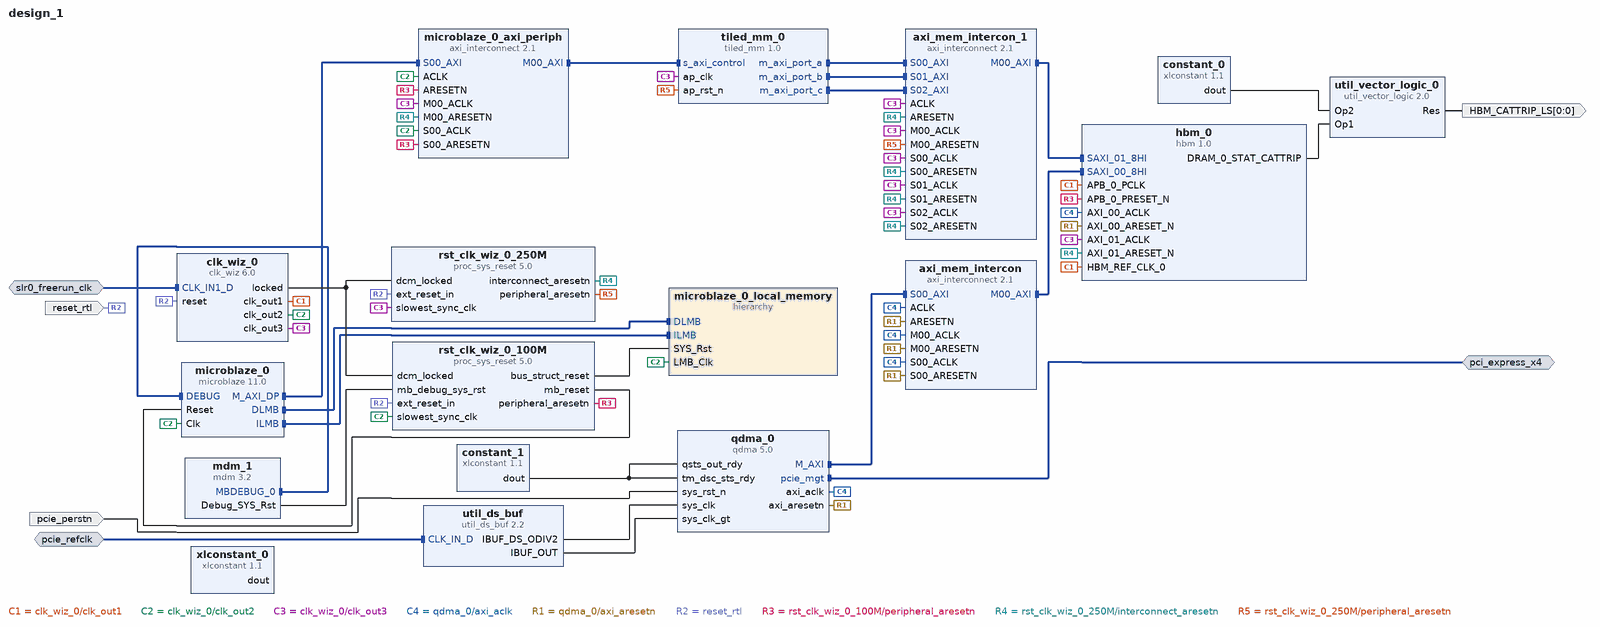
[diagram p0: block diagram of the top level]
# Vivado block design design_1, xcu55c-fsvh2892-2L-e, Vivado 2023.2.2
create_bd_design design_1

create_bd_intf_port -mode Slave -vlnv xilinx.com:interface:diff_clock_rtl:1.0 slr0_freerun_clk
set_property -dict {CONFIG.FREQ_HZ 100000000} [get_bd_intf_ports slr0_freerun_clk]
create_bd_intf_port -mode Master -vlnv xilinx.com:interface:pcie_7x_mgt_rtl:1.0 pci_express_x4
create_bd_intf_port -mode Slave -vlnv xilinx.com:interface:diff_clock_rtl:1.0 pcie_refclk
set_property -dict {CONFIG.FREQ_HZ 100000000} [get_bd_intf_ports pcie_refclk]
create_bd_port -dir I -type rst reset_rtl
set_property -dict {CONFIG.POLARITY ACTIVE_HIGH} [get_bd_ports reset_rtl]
create_bd_port -dir I -type rst pcie_perstn
set_property -dict {CONFIG.POLARITY ACTIVE_LOW} [get_bd_ports pcie_perstn]
create_bd_port -dir O -from 0 -to 0 HBM_CATTRIP_LS

create_bd_cell -type ip -vlnv xilinx.com:ip:clk_wiz:6.0 clk_wiz_0
set_property -dict [list \
  CONFIG.CLKOUT1_JITTER 115.831 \
  CONFIG.CLKOUT1_PHASE_ERROR 87.180 \
  CONFIG.CLKOUT2_JITTER 115.831 \
  CONFIG.CLKOUT2_PHASE_ERROR 87.180 \
  CONFIG.CLKOUT2_USED true \
  CONFIG.CLKOUT3_JITTER 90.074 \
  CONFIG.CLKOUT3_PHASE_ERROR 87.180 \
  CONFIG.CLKOUT3_REQUESTED_OUT_FREQ 400 \
  CONFIG.CLKOUT3_USED true \
  CONFIG.CLK_IN1_BOARD_INTERFACE slr0_freerun_clk \
  CONFIG.MMCM_CLKFBOUT_MULT_F 12.000 \
  CONFIG.MMCM_CLKOUT0_DIVIDE_F 12.000 \
  CONFIG.MMCM_CLKOUT1_DIVIDE 12 \
  CONFIG.MMCM_CLKOUT2_DIVIDE 3 \
  CONFIG.NUM_OUT_CLKS 3 \
  CONFIG.OPTIMIZE_CLOCKING_STRUCTURE_EN true \
  CONFIG.RESET_BOARD_INTERFACE Custom \
  CONFIG.USE_BOARD_FLOW true \
] [get_bd_cells clk_wiz_0]
create_bd_cell -type ip -vlnv xilinx.com:ip:qdma:5.0 qdma_0
set_property -dict [list \
  CONFIG.PCIE_BOARD_INTERFACE pci_express_x4 \
  CONFIG.SYS_RST_N_BOARD_INTERFACE pcie_perstn \
  CONFIG.axi_data_width 256_bit \
  CONFIG.axilite_master_en false \
  CONFIG.axisten_freq 250 \
  CONFIG.dma_intf_sel_qdma AXI_MM \
  CONFIG.pl_link_cap_max_link_speed 16.0_GT/s \
] [get_bd_cells qdma_0]
create_bd_cell -type ip -vlnv xilinx.com:ip:util_ds_buf:2.2 util_ds_buf
set_property -dict {CONFIG.DIFF_CLK_IN_BOARD_INTERFACE pcie_refclk CONFIG.USE_BOARD_FLOW true} [get_bd_cells util_ds_buf]
create_bd_cell -type ip -vlnv xilinx.com:ip:hbm:1.0 hbm_0
set_property -dict [list \
  CONFIG.USER_APB_EN false \
  CONFIG.USER_SAXI_01 true \
  CONFIG.USER_SAXI_02 false \
  CONFIG.USER_SAXI_03 false \
  CONFIG.USER_SAXI_04 false \
  CONFIG.USER_SAXI_05 false \
  CONFIG.USER_SAXI_06 false \
  CONFIG.USER_SAXI_07 false \
  CONFIG.USER_SAXI_08 false \
  CONFIG.USER_SAXI_09 false \
  CONFIG.USER_SAXI_10 false \
  CONFIG.USER_SAXI_11 false \
  CONFIG.USER_SAXI_12 false \
  CONFIG.USER_SAXI_13 false \
  CONFIG.USER_SAXI_14 false \
  CONFIG.USER_SAXI_15 false \
] [get_bd_cells hbm_0]
create_bd_cell -type ip -vlnv xilinx.com:ip:axi_interconnect:2.1 axi_mem_intercon
set_property -dict [list \
  CONFIG.ENABLE_ADVANCED_OPTIONS 0 \
  CONFIG.NUM_MI 1 \
  CONFIG.S00_HAS_DATA_FIFO 0 \
  CONFIG.S00_HAS_REGSLICE 4 \
] [get_bd_cells axi_mem_intercon]
create_bd_cell -type ip -vlnv xilinx.com:ip:xlconstant:1.1 constant_1
create_bd_cell -type ip -vlnv xilinx.com:ip:proc_sys_reset:5.0 rst_clk_wiz_0_100M
create_bd_cell -type ip -vlnv xilinx.com:ip:microblaze:11.0 microblaze_0
set_property -dict [list \
  CONFIG.C_ADDR_SIZE 36 \
  CONFIG.C_DEBUG_ENABLED 1 \
  CONFIG.C_D_AXI 1 \
  CONFIG.C_D_LMB 1 \
  CONFIG.C_I_LMB 1 \
  CONFIG.C_USE_BARREL 1 \
  CONFIG.C_USE_BRANCH_TARGET_CACHE 1 \
  CONFIG.C_USE_FPU 0 \
  CONFIG.C_USE_MSR_INSTR 1 \
  CONFIG.C_USE_PCMP_INSTR 1 \
] [get_bd_cells microblaze_0]
create_bd_cell -type hier microblaze_0_local_memory
create_bd_cell -type ip -vlnv xilinx.com:ip:mdm:3.2 mdm_1
create_bd_cell -type ip -vlnv xilinx.com:ip:axi_interconnect:2.1 microblaze_0_axi_periph
set_property -dict {CONFIG.NUM_MI 1} [get_bd_cells microblaze_0_axi_periph]
create_bd_cell -type ip -vlnv xilinx.com:ip:xlconstant:1.1 constant_0
set_property -dict {CONFIG.CONST_VAL 0} [get_bd_cells constant_0]
create_bd_cell -type ip -vlnv xilinx.com:ip:util_vector_logic:2.0 util_vector_logic_0
set_property -dict {CONFIG.C_OPERATION or CONFIG.C_SIZE 1} [get_bd_cells util_vector_logic_0]
create_bd_cell -type ip -vlnv xilinx.com:hls:tiled_mm:1.0 tiled_mm_0
create_bd_cell -type ip -vlnv xilinx.com:ip:proc_sys_reset:5.0 rst_clk_wiz_0_250M
create_bd_cell -type ip -vlnv xilinx.com:ip:axi_interconnect:2.1 axi_mem_intercon_1
set_property -dict {CONFIG.NUM_MI 1 CONFIG.NUM_SI 3} [get_bd_cells axi_mem_intercon_1]
create_bd_cell -type ip -vlnv xilinx.com:ip:xlconstant:1.1 xlconstant_0

# ---- hierarchy /microblaze_0_local_memory ----
current_bd_instance /microblaze_0_local_memory
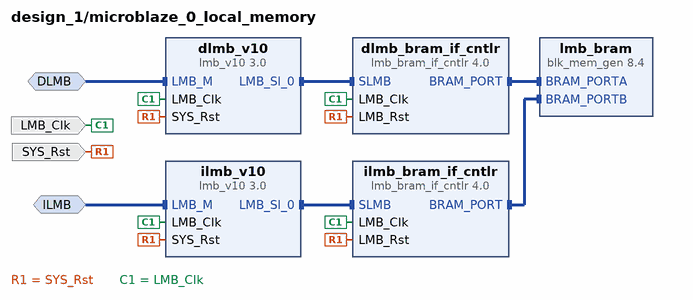
[diagram p1: block diagram inside /microblaze_0_local_memory]
create_bd_intf_pin -mode MirroredMaster -vlnv xilinx.com:interface:lmb_rtl:1.0 DLMB
create_bd_intf_pin -mode MirroredMaster -vlnv xilinx.com:interface:lmb_rtl:1.0 ILMB
create_bd_pin -dir I -type clk LMB_Clk
create_bd_pin -dir I -type rst SYS_Rst

create_bd_cell -type ip -vlnv xilinx.com:ip:lmb_v10:3.0 dlmb_v10
create_bd_cell -type ip -vlnv xilinx.com:ip:lmb_v10:3.0 ilmb_v10
create_bd_cell -type ip -vlnv xilinx.com:ip:lmb_bram_if_cntlr:4.0 dlmb_bram_if_cntlr
set_property -dict {CONFIG.C_ECC 0} [get_bd_cells dlmb_bram_if_cntlr]
create_bd_cell -type ip -vlnv xilinx.com:ip:lmb_bram_if_cntlr:4.0 ilmb_bram_if_cntlr
set_property -dict {CONFIG.C_ECC 0} [get_bd_cells ilmb_bram_if_cntlr]
create_bd_cell -type ip -vlnv xilinx.com:ip:blk_mem_gen:8.4 lmb_bram
set_property -dict {CONFIG.Memory_Type True_Dual_Port_RAM CONFIG.use_bram_block BRAM_Controller} [get_bd_cells lmb_bram]

# ---- connections ----

current_bd_instance /microblaze_0_local_memory
connect_bd_intf_net -intf_net microblaze_0_dlmb [get_bd_intf_pins dlmb_v10/LMB_M] [get_bd_intf_pins DLMB]
connect_bd_intf_net -intf_net microblaze_0_dlmb_bus [get_bd_intf_pins dlmb_v10/LMB_Sl_0] [get_bd_intf_pins dlmb_bram_if_cntlr/SLMB]
connect_bd_intf_net -intf_net microblaze_0_dlmb_cntlr [get_bd_intf_pins dlmb_bram_if_cntlr/BRAM_PORT] [get_bd_intf_pins lmb_bram/BRAM_PORTA]
connect_bd_intf_net -intf_net microblaze_0_ilmb [get_bd_intf_pins ilmb_v10/LMB_M] [get_bd_intf_pins ILMB]
connect_bd_intf_net -intf_net microblaze_0_ilmb_bus [get_bd_intf_pins ilmb_v10/LMB_Sl_0] [get_bd_intf_pins ilmb_bram_if_cntlr/SLMB]
connect_bd_intf_net -intf_net microblaze_0_ilmb_cntlr [get_bd_intf_pins ilmb_bram_if_cntlr/BRAM_PORT] [get_bd_intf_pins lmb_bram/BRAM_PORTB]
connect_bd_net [get_bd_pins SYS_Rst] \
  [get_bd_pins dlmb_v10/SYS_Rst] [get_bd_pins dlmb_bram_if_cntlr/LMB_Rst] [get_bd_pins ilmb_v10/SYS_Rst] \
  [get_bd_pins ilmb_bram_if_cntlr/LMB_Rst]
connect_bd_net -net microblaze_0_Clk [get_bd_pins LMB_Clk] \
  [get_bd_pins dlmb_v10/LMB_Clk] [get_bd_pins dlmb_bram_if_cntlr/LMB_Clk] [get_bd_pins ilmb_v10/LMB_Clk] \
  [get_bd_pins ilmb_bram_if_cntlr/LMB_Clk]
set_property HDL_ATTRIBUTE.BMM_INFO_ADDRESS_SPACE {byte  0x00000000 32 > design_1 microblaze_0_local_memory/lmb_bram} [get_bd_cells dlmb_bram_if_cntlr]
set_property HDL_ATTRIBUTE.KEEP_HIERARCHY yes [get_bd_cells dlmb_bram_if_cntlr]

current_bd_instance /
connect_bd_intf_net [get_bd_intf_pins axi_mem_intercon_1/M00_AXI] [get_bd_intf_pins hbm_0/SAXI_01_8HI]
connect_bd_intf_net [get_bd_intf_pins axi_mem_intercon/M00_AXI] [get_bd_intf_pins hbm_0/SAXI_00_8HI]
connect_bd_intf_net [get_bd_intf_pins microblaze_0/M_AXI_DP] [get_bd_intf_pins microblaze_0_axi_periph/S00_AXI]
connect_bd_intf_net [get_bd_intf_pins microblaze_0_axi_periph/M00_AXI] [get_bd_intf_pins tiled_mm_0/s_axi_control]
connect_bd_intf_net [get_bd_intf_pins mdm_1/MBDEBUG_0] [get_bd_intf_pins microblaze_0/DEBUG]
connect_bd_intf_net [get_bd_intf_pins microblaze_0/DLMB] [get_bd_intf_pins microblaze_0_local_memory/DLMB]
connect_bd_intf_net [get_bd_intf_pins microblaze_0/ILMB] [get_bd_intf_pins microblaze_0_local_memory/ILMB]
connect_bd_intf_net [get_bd_intf_ports pcie_refclk] [get_bd_intf_pins util_ds_buf/CLK_IN_D]
connect_bd_intf_net [get_bd_intf_pins qdma_0/M_AXI] [get_bd_intf_pins axi_mem_intercon/S00_AXI]
connect_bd_intf_net [get_bd_intf_ports pci_express_x4] [get_bd_intf_pins qdma_0/pcie_mgt]
connect_bd_intf_net [get_bd_intf_ports slr0_freerun_clk] [get_bd_intf_pins clk_wiz_0/CLK_IN1_D]
connect_bd_intf_net [get_bd_intf_pins tiled_mm_0/m_axi_port_a] [get_bd_intf_pins axi_mem_intercon_1/S00_AXI]
connect_bd_intf_net [get_bd_intf_pins tiled_mm_0/m_axi_port_b] [get_bd_intf_pins axi_mem_intercon_1/S01_AXI]
connect_bd_intf_net [get_bd_intf_pins tiled_mm_0/m_axi_port_c] [get_bd_intf_pins axi_mem_intercon_1/S02_AXI]
connect_bd_net [get_bd_pins clk_wiz_0/clk_out1] [get_bd_pins hbm_0/HBM_REF_CLK_0] [get_bd_pins hbm_0/APB_0_PCLK]
connect_bd_net [get_bd_pins clk_wiz_0/clk_out2] \
  [get_bd_pins rst_clk_wiz_0_100M/slowest_sync_clk] [get_bd_pins microblaze_0/Clk] \
  [get_bd_pins microblaze_0_local_memory/LMB_Clk] [get_bd_pins microblaze_0_axi_periph/ACLK] \
  [get_bd_pins microblaze_0_axi_periph/S00_ACLK]
connect_bd_net [get_bd_pins clk_wiz_0/clk_out3] \
  [get_bd_pins rst_clk_wiz_0_250M/slowest_sync_clk] [get_bd_pins axi_mem_intercon_1/ACLK] \
  [get_bd_pins axi_mem_intercon_1/S00_ACLK] [get_bd_pins axi_mem_intercon_1/S01_ACLK] \
  [get_bd_pins axi_mem_intercon_1/S02_ACLK] [get_bd_pins microblaze_0_axi_periph/M00_ACLK] [get_bd_pins tiled_mm_0/ap_clk] \
  [get_bd_pins axi_mem_intercon_1/M00_ACLK] [get_bd_pins hbm_0/AXI_01_ACLK]
connect_bd_net [get_bd_pins clk_wiz_0/locked] [get_bd_pins rst_clk_wiz_0_100M/dcm_locked] [get_bd_pins rst_clk_wiz_0_250M/dcm_locked]
connect_bd_net [get_bd_pins constant_0/dout] [get_bd_pins util_vector_logic_0/Op2]
connect_bd_net [get_bd_pins constant_1/dout] [get_bd_pins qdma_0/tm_dsc_sts_rdy] [get_bd_pins qdma_0/qsts_out_rdy]
connect_bd_net [get_bd_pins hbm_0/DRAM_0_STAT_CATTRIP] [get_bd_pins util_vector_logic_0/Op1]
connect_bd_net [get_bd_pins mdm_1/Debug_SYS_Rst] [get_bd_pins rst_clk_wiz_0_100M/mb_debug_sys_rst]
connect_bd_net [get_bd_ports pcie_perstn] [get_bd_pins qdma_0/sys_rst_n]
connect_bd_net [get_bd_pins qdma_0/axi_aclk] \
  [get_bd_pins axi_mem_intercon/S00_ACLK] [get_bd_pins hbm_0/AXI_00_ACLK] [get_bd_pins axi_mem_intercon/M00_ACLK] \
  [get_bd_pins axi_mem_intercon/ACLK]
connect_bd_net [get_bd_pins qdma_0/axi_aresetn] \
  [get_bd_pins axi_mem_intercon/S00_ARESETN] [get_bd_pins axi_mem_intercon/M00_ARESETN] \
  [get_bd_pins axi_mem_intercon/ARESETN] [get_bd_pins hbm_0/AXI_00_ARESET_N]
connect_bd_net [get_bd_ports reset_rtl] \
  [get_bd_pins clk_wiz_0/reset] [get_bd_pins rst_clk_wiz_0_100M/ext_reset_in] [get_bd_pins rst_clk_wiz_0_250M/ext_reset_in]
connect_bd_net [get_bd_pins rst_clk_wiz_0_100M/bus_struct_reset] [get_bd_pins microblaze_0_local_memory/SYS_Rst]
connect_bd_net [get_bd_pins rst_clk_wiz_0_100M/mb_reset] [get_bd_pins microblaze_0/Reset]
connect_bd_net [get_bd_pins rst_clk_wiz_0_100M/peripheral_aresetn] \
  [get_bd_pins microblaze_0_axi_periph/S00_ARESETN] [get_bd_pins microblaze_0_axi_periph/ARESETN] \
  [get_bd_pins hbm_0/APB_0_PRESET_N]
connect_bd_net -net rst_clk_wiz_0_250M_peripheral_aresetn [get_bd_pins rst_clk_wiz_0_250M/interconnect_aresetn] \
  [get_bd_pins axi_mem_intercon_1/S00_ARESETN] [get_bd_pins axi_mem_intercon_1/ARESETN] \
  [get_bd_pins axi_mem_intercon_1/S01_ARESETN] [get_bd_pins axi_mem_intercon_1/S02_ARESETN] \
  [get_bd_pins microblaze_0_axi_periph/M00_ARESETN] [get_bd_pins hbm_0/AXI_01_ARESET_N]
connect_bd_net [get_bd_pins rst_clk_wiz_0_250M/peripheral_aresetn] [get_bd_pins tiled_mm_0/ap_rst_n] [get_bd_pins axi_mem_intercon_1/M00_ARESETN]
connect_bd_net [get_bd_pins util_ds_buf/IBUF_DS_ODIV2] [get_bd_pins qdma_0/sys_clk]
connect_bd_net [get_bd_pins util_ds_buf/IBUF_OUT] [get_bd_pins qdma_0/sys_clk_gt]
connect_bd_net [get_bd_pins util_vector_logic_0/Res] [get_bd_ports HBM_CATTRIP_LS]
# net xlconstant_0_dout has one end: xlconstant_0/dout
set_property HDL_ATTRIBUTE.BMM_INFO_PROCESSOR {microblaze-le > design_1 microblaze_0_local_memory/dlmb_bram_if_cntlr} [get_bd_cells microblaze_0]
set_property HDL_ATTRIBUTE.KEEP_HIERARCHY yes [get_bd_cells microblaze_0]

# ---- address map ----
assign_bd_address -offset 0x200000000 -range 8K -target_address_space [get_bd_addr_spaces microblaze_0/Data] [get_bd_addr_segs microblaze_0_local_memory/dlmb_bram_if_cntlr/SLMB/Mem]
assign_bd_address -offset 0x200010000 -range 64K -target_address_space [get_bd_addr_spaces microblaze_0/Data] [get_bd_addr_segs tiled_mm_0/s_axi_control/Reg]
assign_bd_address -offset 0x00000000 -range 8K -target_address_space [get_bd_addr_spaces microblaze_0/Instruction] [get_bd_addr_segs microblaze_0_local_memory/ilmb_bram_if_cntlr/SLMB/Mem]
assign_bd_address -offset 0x0000000000000000 -range 512M -target_address_space [get_bd_addr_spaces qdma_0/M_AXI] [get_bd_addr_segs hbm_0/SAXI_00_8HI/HBM_MEM00]
assign_bd_address -offset 0x0000000020000000 -range 512M -target_address_space [get_bd_addr_spaces qdma_0/M_AXI] [get_bd_addr_segs hbm_0/SAXI_00_8HI/HBM_MEM01]
assign_bd_address -offset 0x0000000040000000 -range 512M -target_address_space [get_bd_addr_spaces qdma_0/M_AXI] [get_bd_addr_segs hbm_0/SAXI_00_8HI/HBM_MEM02]
assign_bd_address -offset 0x0000000060000000 -range 512M -target_address_space [get_bd_addr_spaces qdma_0/M_AXI] [get_bd_addr_segs hbm_0/SAXI_00_8HI/HBM_MEM03]
assign_bd_address -offset 0x0000000080000000 -range 512M -target_address_space [get_bd_addr_spaces qdma_0/M_AXI] [get_bd_addr_segs hbm_0/SAXI_00_8HI/HBM_MEM04]
assign_bd_address -offset 0x00000000A0000000 -range 512M -target_address_space [get_bd_addr_spaces qdma_0/M_AXI] [get_bd_addr_segs hbm_0/SAXI_00_8HI/HBM_MEM05]
assign_bd_address -offset 0x00000000C0000000 -range 512M -target_address_space [get_bd_addr_spaces qdma_0/M_AXI] [get_bd_addr_segs hbm_0/SAXI_00_8HI/HBM_MEM06]
assign_bd_address -offset 0x00000000E0000000 -range 512M -target_address_space [get_bd_addr_spaces qdma_0/M_AXI] [get_bd_addr_segs hbm_0/SAXI_00_8HI/HBM_MEM07]
assign_bd_address -offset 0x0000000100000000 -range 512M -target_address_space [get_bd_addr_spaces qdma_0/M_AXI] [get_bd_addr_segs hbm_0/SAXI_00_8HI/HBM_MEM08]
assign_bd_address -offset 0x0000000120000000 -range 512M -target_address_space [get_bd_addr_spaces qdma_0/M_AXI] [get_bd_addr_segs hbm_0/SAXI_00_8HI/HBM_MEM09]
assign_bd_address -offset 0x0000000140000000 -range 512M -target_address_space [get_bd_addr_spaces qdma_0/M_AXI] [get_bd_addr_segs hbm_0/SAXI_00_8HI/HBM_MEM10]
assign_bd_address -offset 0x0000000160000000 -range 512M -target_address_space [get_bd_addr_spaces qdma_0/M_AXI] [get_bd_addr_segs hbm_0/SAXI_00_8HI/HBM_MEM11]
assign_bd_address -offset 0x0000000180000000 -range 512M -target_address_space [get_bd_addr_spaces qdma_0/M_AXI] [get_bd_addr_segs hbm_0/SAXI_00_8HI/HBM_MEM12]
assign_bd_address -offset 0x00000001A0000000 -range 512M -target_address_space [get_bd_addr_spaces qdma_0/M_AXI] [get_bd_addr_segs hbm_0/SAXI_00_8HI/HBM_MEM13]
assign_bd_address -offset 0x00000001C0000000 -range 512M -target_address_space [get_bd_addr_spaces qdma_0/M_AXI] [get_bd_addr_segs hbm_0/SAXI_00_8HI/HBM_MEM14]
assign_bd_address -offset 0x00000001E0000000 -range 512M -target_address_space [get_bd_addr_spaces qdma_0/M_AXI] [get_bd_addr_segs hbm_0/SAXI_00_8HI/HBM_MEM15]
assign_bd_address -offset 0x0000000000000000 -range 512M -target_address_space [get_bd_addr_spaces tiled_mm_0/Data_m_axi_port_a] [get_bd_addr_segs hbm_0/SAXI_01_8HI/HBM_MEM00]
assign_bd_address -offset 0x0000000020000000 -range 512M -target_address_space [get_bd_addr_spaces tiled_mm_0/Data_m_axi_port_a] [get_bd_addr_segs hbm_0/SAXI_01_8HI/HBM_MEM01]
assign_bd_address -offset 0x0000000040000000 -range 512M -target_address_space [get_bd_addr_spaces tiled_mm_0/Data_m_axi_port_a] [get_bd_addr_segs hbm_0/SAXI_01_8HI/HBM_MEM02]
assign_bd_address -offset 0x0000000060000000 -range 512M -target_address_space [get_bd_addr_spaces tiled_mm_0/Data_m_axi_port_a] [get_bd_addr_segs hbm_0/SAXI_01_8HI/HBM_MEM03]
assign_bd_address -offset 0x0000000080000000 -range 512M -target_address_space [get_bd_addr_spaces tiled_mm_0/Data_m_axi_port_a] [get_bd_addr_segs hbm_0/SAXI_01_8HI/HBM_MEM04]
assign_bd_address -offset 0x00000000A0000000 -range 512M -target_address_space [get_bd_addr_spaces tiled_mm_0/Data_m_axi_port_a] [get_bd_addr_segs hbm_0/SAXI_01_8HI/HBM_MEM05]
assign_bd_address -offset 0x00000000C0000000 -range 512M -target_address_space [get_bd_addr_spaces tiled_mm_0/Data_m_axi_port_a] [get_bd_addr_segs hbm_0/SAXI_01_8HI/HBM_MEM06]
assign_bd_address -offset 0x00000000E0000000 -range 512M -target_address_space [get_bd_addr_spaces tiled_mm_0/Data_m_axi_port_a] [get_bd_addr_segs hbm_0/SAXI_01_8HI/HBM_MEM07]
assign_bd_address -offset 0x0000000100000000 -range 512M -target_address_space [get_bd_addr_spaces tiled_mm_0/Data_m_axi_port_a] [get_bd_addr_segs hbm_0/SAXI_01_8HI/HBM_MEM08]
assign_bd_address -offset 0x0000000120000000 -range 512M -target_address_space [get_bd_addr_spaces tiled_mm_0/Data_m_axi_port_a] [get_bd_addr_segs hbm_0/SAXI_01_8HI/HBM_MEM09]
assign_bd_address -offset 0x0000000140000000 -range 512M -target_address_space [get_bd_addr_spaces tiled_mm_0/Data_m_axi_port_a] [get_bd_addr_segs hbm_0/SAXI_01_8HI/HBM_MEM10]
assign_bd_address -offset 0x0000000160000000 -range 512M -target_address_space [get_bd_addr_spaces tiled_mm_0/Data_m_axi_port_a] [get_bd_addr_segs hbm_0/SAXI_01_8HI/HBM_MEM11]
assign_bd_address -offset 0x0000000180000000 -range 512M -target_address_space [get_bd_addr_spaces tiled_mm_0/Data_m_axi_port_a] [get_bd_addr_segs hbm_0/SAXI_01_8HI/HBM_MEM12]
assign_bd_address -offset 0x00000001A0000000 -range 512M -target_address_space [get_bd_addr_spaces tiled_mm_0/Data_m_axi_port_a] [get_bd_addr_segs hbm_0/SAXI_01_8HI/HBM_MEM13]
assign_bd_address -offset 0x00000001C0000000 -range 512M -target_address_space [get_bd_addr_spaces tiled_mm_0/Data_m_axi_port_a] [get_bd_addr_segs hbm_0/SAXI_01_8HI/HBM_MEM14]
assign_bd_address -offset 0x00000001E0000000 -range 512M -target_address_space [get_bd_addr_spaces tiled_mm_0/Data_m_axi_port_a] [get_bd_addr_segs hbm_0/SAXI_01_8HI/HBM_MEM15]
assign_bd_address -offset 0x0000000000000000 -range 512M -target_address_space [get_bd_addr_spaces tiled_mm_0/Data_m_axi_port_b] [get_bd_addr_segs hbm_0/SAXI_01_8HI/HBM_MEM00]
assign_bd_address -offset 0x0000000020000000 -range 512M -target_address_space [get_bd_addr_spaces tiled_mm_0/Data_m_axi_port_b] [get_bd_addr_segs hbm_0/SAXI_01_8HI/HBM_MEM01]
assign_bd_address -offset 0x0000000040000000 -range 512M -target_address_space [get_bd_addr_spaces tiled_mm_0/Data_m_axi_port_b] [get_bd_addr_segs hbm_0/SAXI_01_8HI/HBM_MEM02]
assign_bd_address -offset 0x0000000060000000 -range 512M -target_address_space [get_bd_addr_spaces tiled_mm_0/Data_m_axi_port_b] [get_bd_addr_segs hbm_0/SAXI_01_8HI/HBM_MEM03]
assign_bd_address -offset 0x0000000080000000 -range 512M -target_address_space [get_bd_addr_spaces tiled_mm_0/Data_m_axi_port_b] [get_bd_addr_segs hbm_0/SAXI_01_8HI/HBM_MEM04]
assign_bd_address -offset 0x00000000A0000000 -range 512M -target_address_space [get_bd_addr_spaces tiled_mm_0/Data_m_axi_port_b] [get_bd_addr_segs hbm_0/SAXI_01_8HI/HBM_MEM05]
assign_bd_address -offset 0x00000000C0000000 -range 512M -target_address_space [get_bd_addr_spaces tiled_mm_0/Data_m_axi_port_b] [get_bd_addr_segs hbm_0/SAXI_01_8HI/HBM_MEM06]
assign_bd_address -offset 0x00000000E0000000 -range 512M -target_address_space [get_bd_addr_spaces tiled_mm_0/Data_m_axi_port_b] [get_bd_addr_segs hbm_0/SAXI_01_8HI/HBM_MEM07]
assign_bd_address -offset 0x0000000100000000 -range 512M -target_address_space [get_bd_addr_spaces tiled_mm_0/Data_m_axi_port_b] [get_bd_addr_segs hbm_0/SAXI_01_8HI/HBM_MEM08]
assign_bd_address -offset 0x0000000120000000 -range 512M -target_address_space [get_bd_addr_spaces tiled_mm_0/Data_m_axi_port_b] [get_bd_addr_segs hbm_0/SAXI_01_8HI/HBM_MEM09]
assign_bd_address -offset 0x0000000140000000 -range 512M -target_address_space [get_bd_addr_spaces tiled_mm_0/Data_m_axi_port_b] [get_bd_addr_segs hbm_0/SAXI_01_8HI/HBM_MEM10]
assign_bd_address -offset 0x0000000160000000 -range 512M -target_address_space [get_bd_addr_spaces tiled_mm_0/Data_m_axi_port_b] [get_bd_addr_segs hbm_0/SAXI_01_8HI/HBM_MEM11]
assign_bd_address -offset 0x0000000180000000 -range 512M -target_address_space [get_bd_addr_spaces tiled_mm_0/Data_m_axi_port_b] [get_bd_addr_segs hbm_0/SAXI_01_8HI/HBM_MEM12]
assign_bd_address -offset 0x00000001A0000000 -range 512M -target_address_space [get_bd_addr_spaces tiled_mm_0/Data_m_axi_port_b] [get_bd_addr_segs hbm_0/SAXI_01_8HI/HBM_MEM13]
assign_bd_address -offset 0x00000001C0000000 -range 512M -target_address_space [get_bd_addr_spaces tiled_mm_0/Data_m_axi_port_b] [get_bd_addr_segs hbm_0/SAXI_01_8HI/HBM_MEM14]
assign_bd_address -offset 0x00000001E0000000 -range 512M -target_address_space [get_bd_addr_spaces tiled_mm_0/Data_m_axi_port_b] [get_bd_addr_segs hbm_0/SAXI_01_8HI/HBM_MEM15]
assign_bd_address -offset 0x0000000000000000 -range 512M -target_address_space [get_bd_addr_spaces tiled_mm_0/Data_m_axi_port_c] [get_bd_addr_segs hbm_0/SAXI_01_8HI/HBM_MEM00]
assign_bd_address -offset 0x0000000020000000 -range 512M -target_address_space [get_bd_addr_spaces tiled_mm_0/Data_m_axi_port_c] [get_bd_addr_segs hbm_0/SAXI_01_8HI/HBM_MEM01]
assign_bd_address -offset 0x0000000040000000 -range 512M -target_address_space [get_bd_addr_spaces tiled_mm_0/Data_m_axi_port_c] [get_bd_addr_segs hbm_0/SAXI_01_8HI/HBM_MEM02]
assign_bd_address -offset 0x0000000060000000 -range 512M -target_address_space [get_bd_addr_spaces tiled_mm_0/Data_m_axi_port_c] [get_bd_addr_segs hbm_0/SAXI_01_8HI/HBM_MEM03]
assign_bd_address -offset 0x0000000080000000 -range 512M -target_address_space [get_bd_addr_spaces tiled_mm_0/Data_m_axi_port_c] [get_bd_addr_segs hbm_0/SAXI_01_8HI/HBM_MEM04]
assign_bd_address -offset 0x00000000A0000000 -range 512M -target_address_space [get_bd_addr_spaces tiled_mm_0/Data_m_axi_port_c] [get_bd_addr_segs hbm_0/SAXI_01_8HI/HBM_MEM05]
assign_bd_address -offset 0x00000000C0000000 -range 512M -target_address_space [get_bd_addr_spaces tiled_mm_0/Data_m_axi_port_c] [get_bd_addr_segs hbm_0/SAXI_01_8HI/HBM_MEM06]
assign_bd_address -offset 0x00000000E0000000 -range 512M -target_address_space [get_bd_addr_spaces tiled_mm_0/Data_m_axi_port_c] [get_bd_addr_segs hbm_0/SAXI_01_8HI/HBM_MEM07]
assign_bd_address -offset 0x0000000100000000 -range 512M -target_address_space [get_bd_addr_spaces tiled_mm_0/Data_m_axi_port_c] [get_bd_addr_segs hbm_0/SAXI_01_8HI/HBM_MEM08]
assign_bd_address -offset 0x0000000120000000 -range 512M -target_address_space [get_bd_addr_spaces tiled_mm_0/Data_m_axi_port_c] [get_bd_addr_segs hbm_0/SAXI_01_8HI/HBM_MEM09]
assign_bd_address -offset 0x0000000140000000 -range 512M -target_address_space [get_bd_addr_spaces tiled_mm_0/Data_m_axi_port_c] [get_bd_addr_segs hbm_0/SAXI_01_8HI/HBM_MEM10]
assign_bd_address -offset 0x0000000160000000 -range 512M -target_address_space [get_bd_addr_spaces tiled_mm_0/Data_m_axi_port_c] [get_bd_addr_segs hbm_0/SAXI_01_8HI/HBM_MEM11]
assign_bd_address -offset 0x0000000180000000 -range 512M -target_address_space [get_bd_addr_spaces tiled_mm_0/Data_m_axi_port_c] [get_bd_addr_segs hbm_0/SAXI_01_8HI/HBM_MEM12]
assign_bd_address -offset 0x00000001A0000000 -range 512M -target_address_space [get_bd_addr_spaces tiled_mm_0/Data_m_axi_port_c] [get_bd_addr_segs hbm_0/SAXI_01_8HI/HBM_MEM13]
assign_bd_address -offset 0x00000001C0000000 -range 512M -target_address_space [get_bd_addr_spaces tiled_mm_0/Data_m_axi_port_c] [get_bd_addr_segs hbm_0/SAXI_01_8HI/HBM_MEM14]
assign_bd_address -offset 0x00000001E0000000 -range 512M -target_address_space [get_bd_addr_spaces tiled_mm_0/Data_m_axi_port_c] [get_bd_addr_segs hbm_0/SAXI_01_8HI/HBM_MEM15]

validate_bd_design
save_bd_design
